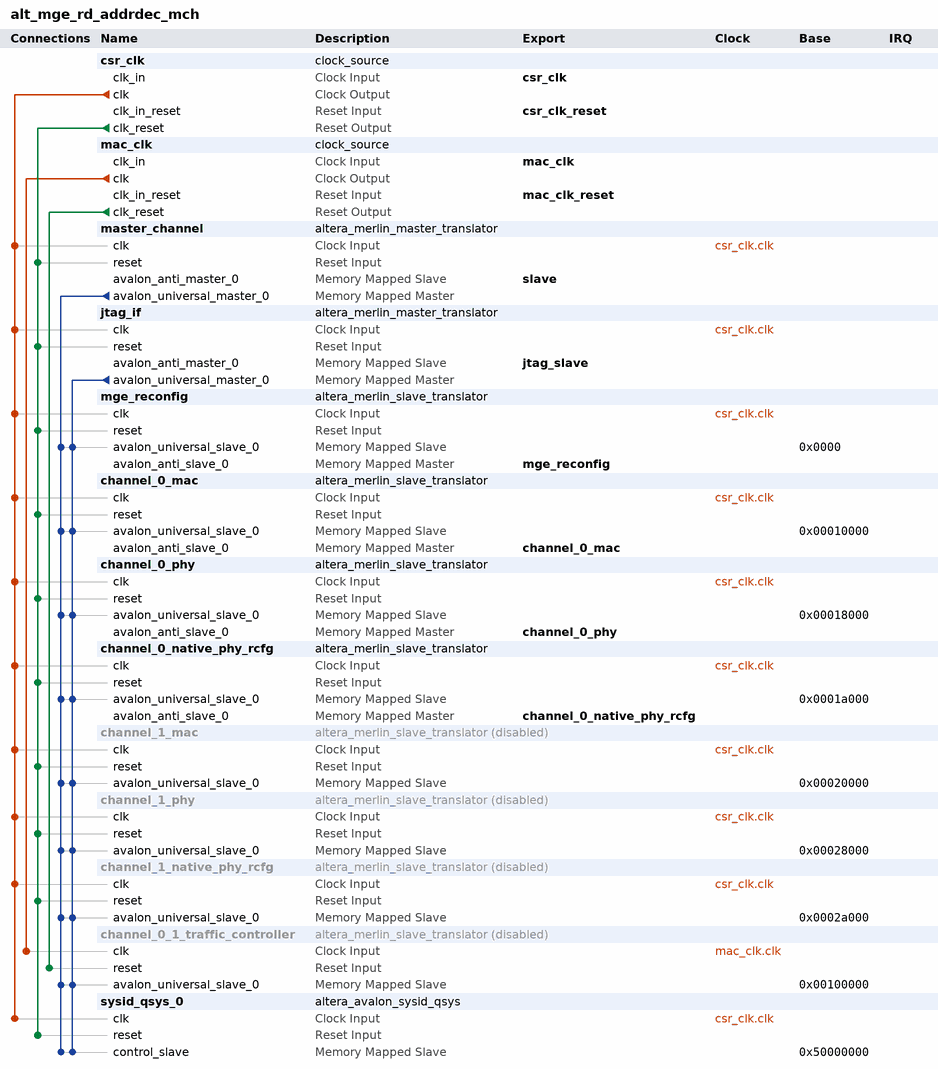
[diagram p0: system contents]
# Platform Designer (Qsys) system alt_mge_rd_addrdec_mch, Stratix 10 1SM21BHU2F53E1VG
# Parameters at their usual value, and those the tool derives, are not listed.
package require -exact qsys 1.0
create_system alt_mge_rd_addrdec_mch
set_project_property DEVICE_FAMILY {Stratix 10}
set_project_property DEVICE 1SM21BHU2F53E1VG

add_component csr_clk ip/alt_mge_rd_addrdec_mch/alt_mge_rd_addrdec_mch_csr_clk.ip clock_source csr_clk 
load_component csr_clk
set_component_parameter_value clockFrequency 125000000
save_component

add_component mac_clk ip/alt_mge_rd_addrdec_mch/alt_mge_rd_addrdec_mch_mac_clk.ip clock_source mac_clk 
load_component mac_clk
set_component_parameter_value clockFrequency 156250000
save_component

add_component master_channel ip/alt_mge_rd_addrdec_mch/alt_mge_rd_addrdec_mch_master_channel.ip altera_merlin_master_translator master_channel 19.1
load_component master_channel
set_component_parameter_value AV_ADDRESS_W 24
set_component_parameter_value AV_DATA_W 32
set_component_parameter_value AV_BURSTCOUNT_W 3
set_component_parameter_value AV_BYTEENABLE_W 4
set_component_parameter_value UAV_ADDRESS_W 32
set_component_parameter_value UAV_BURSTCOUNT_W 3
set_component_parameter_value AV_READLATENCY 0
set_component_parameter_value AV_WRITE_WAIT 0
set_component_parameter_value AV_READ_WAIT 0
set_component_parameter_value AV_DATA_HOLD 0
set_component_parameter_value AV_SETUP_WAIT 0
set_component_parameter_value USE_READDATA 1
set_component_parameter_value USE_WRITEDATA 1
set_component_parameter_value USE_READ 1
set_component_parameter_value USE_WRITE 1
set_component_parameter_value USE_BEGINBURSTTRANSFER 0
set_component_parameter_value USE_BEGINTRANSFER 0
set_component_parameter_value USE_BYTEENABLE 0
set_component_parameter_value USE_CHIPSELECT 0
set_component_parameter_value USE_ADDRESS 1
set_component_parameter_value USE_BURSTCOUNT 0
set_component_parameter_value USE_DEBUGACCESS 0
set_component_parameter_value USE_CLKEN 0
set_component_parameter_value USE_READDATAVALID 0
set_component_parameter_value USE_WAITREQUEST 1
set_component_parameter_value USE_LOCK 0
set_component_parameter_value USE_READRESPONSE 0
set_component_parameter_value USE_WRITERESPONSE 0
set_component_parameter_value AV_SYMBOLS_PER_WORD 4
set_component_parameter_value AV_ADDRESS_SYMBOLS 1
set_component_parameter_value AV_BURSTCOUNT_SYMBOLS 1
set_component_parameter_value AV_CONSTANT_BURST_BEHAVIOR 0
set_component_parameter_value UAV_CONSTANT_BURST_BEHAVIOR 0
set_component_parameter_value AV_LINEWRAPBURSTS 0
set_component_parameter_value AV_MAX_PENDING_READ_TRANSACTIONS 0
set_component_parameter_value AV_BURSTBOUNDARIES 0
set_component_parameter_value AV_INTERLEAVEBURSTS 0
set_component_parameter_value AV_BITS_PER_SYMBOL 8
set_component_parameter_value AV_ISBIGENDIAN 0
set_component_parameter_value AV_ADDRESSGROUP 0
set_component_parameter_value UAV_ADDRESSGROUP 0
set_component_parameter_value AV_REGISTEROUTGOINGSIGNALS 0
set_component_parameter_value AV_REGISTERINCOMINGSIGNALS 0
set_component_parameter_value AV_ALWAYSBURSTMAXBURST 0
set_component_parameter_value SYNC_RESET 0
set_component_parameter_value WAITREQUEST_ALLOWANCE 0
save_component

add_component jtag_if ip/alt_mge_rd_addrdec_mch/alt_mge_rd_addrdec_mch_jtag_if.ip altera_merlin_master_translator jtag_if 19.1
load_component jtag_if
set_component_parameter_value AV_ADDRESS_W 32
set_component_parameter_value AV_DATA_W 32
set_component_parameter_value AV_BURSTCOUNT_W 3
set_component_parameter_value AV_BYTEENABLE_W 4
set_component_parameter_value UAV_ADDRESS_W 32
set_component_parameter_value UAV_BURSTCOUNT_W 3
set_component_parameter_value AV_READLATENCY 0
set_component_parameter_value AV_WRITE_WAIT 0
set_component_parameter_value AV_READ_WAIT 0
set_component_parameter_value AV_DATA_HOLD 0
set_component_parameter_value AV_SETUP_WAIT 0
set_component_parameter_value USE_READDATA 1
set_component_parameter_value USE_WRITEDATA 1
set_component_parameter_value USE_READ 1
set_component_parameter_value USE_WRITE 1
set_component_parameter_value USE_BEGINBURSTTRANSFER 0
set_component_parameter_value USE_BEGINTRANSFER 0
set_component_parameter_value USE_BYTEENABLE 1
set_component_parameter_value USE_CHIPSELECT 0
set_component_parameter_value USE_ADDRESS 1
set_component_parameter_value USE_BURSTCOUNT 0
set_component_parameter_value USE_DEBUGACCESS 0
set_component_parameter_value USE_CLKEN 0
set_component_parameter_value USE_READDATAVALID 1
set_component_parameter_value USE_WAITREQUEST 1
set_component_parameter_value USE_LOCK 0
set_component_parameter_value USE_READRESPONSE 0
set_component_parameter_value USE_WRITERESPONSE 0
set_component_parameter_value AV_SYMBOLS_PER_WORD 4
set_component_parameter_value AV_ADDRESS_SYMBOLS 1
set_component_parameter_value AV_BURSTCOUNT_SYMBOLS 1
set_component_parameter_value AV_CONSTANT_BURST_BEHAVIOR 0
set_component_parameter_value UAV_CONSTANT_BURST_BEHAVIOR 0
set_component_parameter_value AV_LINEWRAPBURSTS 0
set_component_parameter_value AV_MAX_PENDING_READ_TRANSACTIONS 1
set_component_parameter_value AV_BURSTBOUNDARIES 0
set_component_parameter_value AV_INTERLEAVEBURSTS 0
set_component_parameter_value AV_BITS_PER_SYMBOL 8
set_component_parameter_value AV_ISBIGENDIAN 0
set_component_parameter_value AV_ADDRESSGROUP 0
set_component_parameter_value UAV_ADDRESSGROUP 0
set_component_parameter_value AV_REGISTEROUTGOINGSIGNALS 0
set_component_parameter_value AV_REGISTERINCOMINGSIGNALS 0
set_component_parameter_value AV_ALWAYSBURSTMAXBURST 0
set_component_parameter_value SYNC_RESET 0
set_component_parameter_value WAITREQUEST_ALLOWANCE 0
save_component

add_component mge_reconfig ip/alt_mge_rd_addrdec_mch/alt_mge_rd_addrdec_mch_mge_reconfig.ip altera_merlin_slave_translator mge_reconfig 19.1
load_component mge_reconfig
set_component_parameter_value AV_ADDRESS_W 2
set_component_parameter_value AV_DATA_W 32
set_component_parameter_value UAV_DATA_W 32
set_component_parameter_value AV_BURSTCOUNT_W 1
set_component_parameter_value AV_BYTEENABLE_W 4
set_component_parameter_value UAV_BYTEENABLE_W 4
set_component_parameter_value UAV_ADDRESS_W 4
set_component_parameter_value UAV_BURSTCOUNT_W 3
set_component_parameter_value AV_READLATENCY 1
set_component_parameter_value AV_SETUP_WAIT 0
set_component_parameter_value AV_WRITE_WAIT 0
set_component_parameter_value AV_READ_WAIT 0
set_component_parameter_value AV_DATA_HOLD 0
set_component_parameter_value AV_TIMING_UNITS 1
set_component_parameter_value USE_READDATA 1
set_component_parameter_value USE_WRITEDATA 1
set_component_parameter_value USE_READ 1
set_component_parameter_value USE_WRITE 1
set_component_parameter_value USE_BEGINBURSTTRANSFER 0
set_component_parameter_value USE_BEGINTRANSFER 0
set_component_parameter_value USE_BYTEENABLE 0
set_component_parameter_value USE_CHIPSELECT 0
set_component_parameter_value USE_ADDRESS 1
set_component_parameter_value USE_BURSTCOUNT 0
set_component_parameter_value USE_READDATAVALID 0
set_component_parameter_value USE_WAITREQUEST 0
set_component_parameter_value USE_WRITEBYTEENABLE 0
set_component_parameter_value USE_LOCK 0
set_component_parameter_value USE_AV_CLKEN 0
set_component_parameter_value USE_UAV_CLKEN 0
set_component_parameter_value USE_OUTPUTENABLE 0
set_component_parameter_value USE_DEBUGACCESS 0
set_component_parameter_value USE_READRESPONSE 0
set_component_parameter_value USE_WRITERESPONSE 0
set_component_parameter_value AV_SYMBOLS_PER_WORD 4
set_component_parameter_value AV_ADDRESS_SYMBOLS 0
set_component_parameter_value AV_BURSTCOUNT_SYMBOLS 1
set_component_parameter_value AV_CONSTANT_BURST_BEHAVIOR 0
set_component_parameter_value UAV_CONSTANT_BURST_BEHAVIOR 0
set_component_parameter_value AV_REQUIRE_UNALIGNED_ADDRESSES 0
set_component_parameter_value AV_LINEWRAPBURSTS 0
set_component_parameter_value AV_MAX_PENDING_READ_TRANSACTIONS 1
set_component_parameter_value AV_MAX_PENDING_WRITE_TRANSACTIONS 0
set_component_parameter_value AV_BURSTBOUNDARIES 0
set_component_parameter_value AV_INTERLEAVEBURSTS 0
set_component_parameter_value AV_BITS_PER_SYMBOL 8
set_component_parameter_value AV_ISBIGENDIAN 0
set_component_parameter_value AV_ADDRESSGROUP 0
set_component_parameter_value UAV_ADDRESSGROUP 0
set_component_parameter_value AV_REGISTEROUTGOINGSIGNALS 0
set_component_parameter_value AV_REGISTERINCOMINGSIGNALS 0
set_component_parameter_value AV_ALWAYSBURSTMAXBURST 0
set_component_parameter_value CHIPSELECT_THROUGH_READLATENCY 0
set_component_parameter_value CLOCK_RATE 125000000
set_component_parameter_value AV_READ_WAIT_CYCLES 0
set_component_parameter_value AV_WRITE_WAIT_CYCLES 0
set_component_parameter_value AV_SETUP_WAIT_CYCLES 0
set_component_parameter_value AV_DATA_HOLD_CYCLES 0
set_component_parameter_value WAITREQUEST_ALLOWANCE 0
set_component_parameter_value SYNC_RESET 0
save_component

add_component channel_0_mac ip/alt_mge_rd_addrdec_mch/alt_mge_rd_addrdec_mch_channel_0_mac.ip altera_merlin_slave_translator channel_0_mac 19.1
load_component channel_0_mac
set_component_parameter_value AV_ADDRESS_W 10
set_component_parameter_value AV_DATA_W 32
set_component_parameter_value UAV_DATA_W 32
set_component_parameter_value AV_BURSTCOUNT_W 1
set_component_parameter_value AV_BYTEENABLE_W 4
set_component_parameter_value UAV_BYTEENABLE_W 4
set_component_parameter_value UAV_ADDRESS_W 12
set_component_parameter_value UAV_BURSTCOUNT_W 3
set_component_parameter_value AV_READLATENCY 0
set_component_parameter_value AV_SETUP_WAIT 0
set_component_parameter_value AV_WRITE_WAIT 0
set_component_parameter_value AV_READ_WAIT 0
set_component_parameter_value AV_DATA_HOLD 0
set_component_parameter_value AV_TIMING_UNITS 1
set_component_parameter_value USE_READDATA 1
set_component_parameter_value USE_WRITEDATA 1
set_component_parameter_value USE_READ 1
set_component_parameter_value USE_WRITE 1
set_component_parameter_value USE_BEGINBURSTTRANSFER 0
set_component_parameter_value USE_BEGINTRANSFER 0
set_component_parameter_value USE_BYTEENABLE 0
set_component_parameter_value USE_CHIPSELECT 0
set_component_parameter_value USE_ADDRESS 1
set_component_parameter_value USE_BURSTCOUNT 0
set_component_parameter_value USE_READDATAVALID 0
set_component_parameter_value USE_WAITREQUEST 1
set_component_parameter_value USE_WRITEBYTEENABLE 0
set_component_parameter_value USE_LOCK 0
set_component_parameter_value USE_AV_CLKEN 0
set_component_parameter_value USE_UAV_CLKEN 0
set_component_parameter_value USE_OUTPUTENABLE 0
set_component_parameter_value USE_DEBUGACCESS 0
set_component_parameter_value USE_READRESPONSE 0
set_component_parameter_value USE_WRITERESPONSE 0
set_component_parameter_value AV_SYMBOLS_PER_WORD 4
set_component_parameter_value AV_ADDRESS_SYMBOLS 0
set_component_parameter_value AV_BURSTCOUNT_SYMBOLS 1
set_component_parameter_value AV_CONSTANT_BURST_BEHAVIOR 0
set_component_parameter_value UAV_CONSTANT_BURST_BEHAVIOR 0
set_component_parameter_value AV_REQUIRE_UNALIGNED_ADDRESSES 0
set_component_parameter_value AV_LINEWRAPBURSTS 0
set_component_parameter_value AV_MAX_PENDING_READ_TRANSACTIONS 1
set_component_parameter_value AV_MAX_PENDING_WRITE_TRANSACTIONS 0
set_component_parameter_value AV_BURSTBOUNDARIES 0
set_component_parameter_value AV_INTERLEAVEBURSTS 0
set_component_parameter_value AV_BITS_PER_SYMBOL 8
set_component_parameter_value AV_ISBIGENDIAN 0
set_component_parameter_value AV_ADDRESSGROUP 0
set_component_parameter_value UAV_ADDRESSGROUP 0
set_component_parameter_value AV_REGISTEROUTGOINGSIGNALS 0
set_component_parameter_value AV_REGISTERINCOMINGSIGNALS 0
set_component_parameter_value AV_ALWAYSBURSTMAXBURST 0
set_component_parameter_value CHIPSELECT_THROUGH_READLATENCY 0
set_component_parameter_value CLOCK_RATE 125000000
set_component_parameter_value AV_READ_WAIT_CYCLES 0
set_component_parameter_value AV_WRITE_WAIT_CYCLES 0
set_component_parameter_value AV_SETUP_WAIT_CYCLES 0
set_component_parameter_value AV_DATA_HOLD_CYCLES 0
set_component_parameter_value WAITREQUEST_ALLOWANCE 0
set_component_parameter_value SYNC_RESET 0
save_component

add_component channel_0_phy ip/alt_mge_rd_addrdec_mch/alt_mge_rd_addrdec_mch_channel_0_phy.ip altera_merlin_slave_translator channel_0_phy 19.1
load_component channel_0_phy
set_component_parameter_value AV_ADDRESS_W 5
set_component_parameter_value AV_DATA_W 32
set_component_parameter_value UAV_DATA_W 32
set_component_parameter_value AV_BURSTCOUNT_W 1
set_component_parameter_value AV_BYTEENABLE_W 4
set_component_parameter_value UAV_BYTEENABLE_W 4
set_component_parameter_value UAV_ADDRESS_W 7
set_component_parameter_value UAV_BURSTCOUNT_W 3
set_component_parameter_value AV_READLATENCY 0
set_component_parameter_value AV_SETUP_WAIT 0
set_component_parameter_value AV_WRITE_WAIT 0
set_component_parameter_value AV_READ_WAIT 0
set_component_parameter_value AV_DATA_HOLD 0
set_component_parameter_value AV_TIMING_UNITS 1
set_component_parameter_value USE_READDATA 1
set_component_parameter_value USE_WRITEDATA 1
set_component_parameter_value USE_READ 1
set_component_parameter_value USE_WRITE 1
set_component_parameter_value USE_BEGINBURSTTRANSFER 0
set_component_parameter_value USE_BEGINTRANSFER 0
set_component_parameter_value USE_BYTEENABLE 0
set_component_parameter_value USE_CHIPSELECT 0
set_component_parameter_value USE_ADDRESS 1
set_component_parameter_value USE_BURSTCOUNT 0
set_component_parameter_value USE_READDATAVALID 0
set_component_parameter_value USE_WAITREQUEST 1
set_component_parameter_value USE_WRITEBYTEENABLE 0
set_component_parameter_value USE_LOCK 0
set_component_parameter_value USE_AV_CLKEN 0
set_component_parameter_value USE_UAV_CLKEN 0
set_component_parameter_value USE_OUTPUTENABLE 0
set_component_parameter_value USE_DEBUGACCESS 0
set_component_parameter_value USE_READRESPONSE 0
set_component_parameter_value USE_WRITERESPONSE 0
set_component_parameter_value AV_SYMBOLS_PER_WORD 4
set_component_parameter_value AV_ADDRESS_SYMBOLS 0
set_component_parameter_value AV_BURSTCOUNT_SYMBOLS 1
set_component_parameter_value AV_CONSTANT_BURST_BEHAVIOR 0
set_component_parameter_value UAV_CONSTANT_BURST_BEHAVIOR 0
set_component_parameter_value AV_REQUIRE_UNALIGNED_ADDRESSES 0
set_component_parameter_value AV_LINEWRAPBURSTS 0
set_component_parameter_value AV_MAX_PENDING_READ_TRANSACTIONS 1
set_component_parameter_value AV_MAX_PENDING_WRITE_TRANSACTIONS 0
set_component_parameter_value AV_BURSTBOUNDARIES 0
set_component_parameter_value AV_INTERLEAVEBURSTS 0
set_component_parameter_value AV_BITS_PER_SYMBOL 8
set_component_parameter_value AV_ISBIGENDIAN 0
set_component_parameter_value AV_ADDRESSGROUP 0
set_component_parameter_value UAV_ADDRESSGROUP 0
set_component_parameter_value AV_REGISTEROUTGOINGSIGNALS 0
set_component_parameter_value AV_REGISTERINCOMINGSIGNALS 0
set_component_parameter_value AV_ALWAYSBURSTMAXBURST 0
set_component_parameter_value CHIPSELECT_THROUGH_READLATENCY 0
set_component_parameter_value CLOCK_RATE 125000000
set_component_parameter_value AV_READ_WAIT_CYCLES 0
set_component_parameter_value AV_WRITE_WAIT_CYCLES 0
set_component_parameter_value AV_SETUP_WAIT_CYCLES 0
set_component_parameter_value AV_DATA_HOLD_CYCLES 0
set_component_parameter_value WAITREQUEST_ALLOWANCE 0
set_component_parameter_value SYNC_RESET 0
save_component

add_component channel_0_native_phy_rcfg ip/alt_mge_rd_addrdec_mch/alt_mge_rd_addrdec_mch_channel_0_native_phy_rcfg.ip altera_merlin_slave_translator channel_0_native_phy_rcfg 19.1
load_component channel_0_native_phy_rcfg
set_component_parameter_value AV_ADDRESS_W 10
set_component_parameter_value AV_DATA_W 32
set_component_parameter_value UAV_DATA_W 32
set_component_parameter_value AV_BURSTCOUNT_W 1
set_component_parameter_value AV_BYTEENABLE_W 4
set_component_parameter_value UAV_BYTEENABLE_W 4
set_component_parameter_value UAV_ADDRESS_W 12
set_component_parameter_value UAV_BURSTCOUNT_W 3
set_component_parameter_value AV_READLATENCY 0
set_component_parameter_value AV_SETUP_WAIT 0
set_component_parameter_value AV_WRITE_WAIT 0
set_component_parameter_value AV_READ_WAIT 0
set_component_parameter_value AV_DATA_HOLD 0
set_component_parameter_value AV_TIMING_UNITS 1
set_component_parameter_value USE_READDATA 1
set_component_parameter_value USE_WRITEDATA 1
set_component_parameter_value USE_READ 1
set_component_parameter_value USE_WRITE 1
set_component_parameter_value USE_BEGINBURSTTRANSFER 0
set_component_parameter_value USE_BEGINTRANSFER 0
set_component_parameter_value USE_BYTEENABLE 0
set_component_parameter_value USE_CHIPSELECT 0
set_component_parameter_value USE_ADDRESS 1
set_component_parameter_value USE_BURSTCOUNT 0
set_component_parameter_value USE_READDATAVALID 0
set_component_parameter_value USE_WAITREQUEST 1
set_component_parameter_value USE_WRITEBYTEENABLE 0
set_component_parameter_value USE_LOCK 0
set_component_parameter_value USE_AV_CLKEN 0
set_component_parameter_value USE_UAV_CLKEN 0
set_component_parameter_value USE_OUTPUTENABLE 0
set_component_parameter_value USE_DEBUGACCESS 0
set_component_parameter_value USE_READRESPONSE 0
set_component_parameter_value USE_WRITERESPONSE 0
set_component_parameter_value AV_SYMBOLS_PER_WORD 4
set_component_parameter_value AV_ADDRESS_SYMBOLS 0
set_component_parameter_value AV_BURSTCOUNT_SYMBOLS 1
set_component_parameter_value AV_CONSTANT_BURST_BEHAVIOR 0
set_component_parameter_value UAV_CONSTANT_BURST_BEHAVIOR 0
set_component_parameter_value AV_REQUIRE_UNALIGNED_ADDRESSES 0
set_component_parameter_value AV_LINEWRAPBURSTS 0
set_component_parameter_value AV_MAX_PENDING_READ_TRANSACTIONS 1
set_component_parameter_value AV_MAX_PENDING_WRITE_TRANSACTIONS 0
set_component_parameter_value AV_BURSTBOUNDARIES 0
set_component_parameter_value AV_INTERLEAVEBURSTS 0
set_component_parameter_value AV_BITS_PER_SYMBOL 8
set_component_parameter_value AV_ISBIGENDIAN 0
set_component_parameter_value AV_ADDRESSGROUP 0
set_component_parameter_value UAV_ADDRESSGROUP 0
set_component_parameter_value AV_REGISTEROUTGOINGSIGNALS 0
set_component_parameter_value AV_REGISTERINCOMINGSIGNALS 0
set_component_parameter_value AV_ALWAYSBURSTMAXBURST 0
set_component_parameter_value CHIPSELECT_THROUGH_READLATENCY 0
set_component_parameter_value CLOCK_RATE 125000000
set_component_parameter_value AV_READ_WAIT_CYCLES 0
set_component_parameter_value AV_WRITE_WAIT_CYCLES 0
set_component_parameter_value AV_SETUP_WAIT_CYCLES 0
set_component_parameter_value AV_DATA_HOLD_CYCLES 0
set_component_parameter_value WAITREQUEST_ALLOWANCE 0
set_component_parameter_value SYNC_RESET 0
save_component

add_component channel_1_mac ip/alt_mge_rd_addrdec_mch/alt_mge_rd_addrdec_mch_channel_1_mac.ip altera_merlin_slave_translator channel_1_mac 19.1
load_component channel_1_mac
set_instance_property channel_1_mac ENABLED false
set_component_parameter_value AV_ADDRESS_W 10
set_component_parameter_value AV_DATA_W 32
set_component_parameter_value UAV_DATA_W 32
set_component_parameter_value AV_BURSTCOUNT_W 1
set_component_parameter_value AV_BYTEENABLE_W 4
set_component_parameter_value UAV_BYTEENABLE_W 4
set_component_parameter_value UAV_ADDRESS_W 12
set_component_parameter_value UAV_BURSTCOUNT_W 3
set_component_parameter_value AV_READLATENCY 0
set_component_parameter_value AV_SETUP_WAIT 0
set_component_parameter_value AV_WRITE_WAIT 0
set_component_parameter_value AV_READ_WAIT 0
set_component_parameter_value AV_DATA_HOLD 0
set_component_parameter_value AV_TIMING_UNITS 1
set_component_parameter_value USE_READDATA 1
set_component_parameter_value USE_WRITEDATA 1
set_component_parameter_value USE_READ 1
set_component_parameter_value USE_WRITE 1
set_component_parameter_value USE_BEGINBURSTTRANSFER 0
set_component_parameter_value USE_BEGINTRANSFER 0
set_component_parameter_value USE_BYTEENABLE 0
set_component_parameter_value USE_CHIPSELECT 0
set_component_parameter_value USE_ADDRESS 1
set_component_parameter_value USE_BURSTCOUNT 0
set_component_parameter_value USE_READDATAVALID 0
set_component_parameter_value USE_WAITREQUEST 1
set_component_parameter_value USE_WRITEBYTEENABLE 0
set_component_parameter_value USE_LOCK 0
set_component_parameter_value USE_AV_CLKEN 0
set_component_parameter_value USE_UAV_CLKEN 0
set_component_parameter_value USE_OUTPUTENABLE 0
set_component_parameter_value USE_DEBUGACCESS 0
set_component_parameter_value USE_READRESPONSE 0
set_component_parameter_value USE_WRITERESPONSE 0
set_component_parameter_value AV_SYMBOLS_PER_WORD 4
set_component_parameter_value AV_ADDRESS_SYMBOLS 0
set_component_parameter_value AV_BURSTCOUNT_SYMBOLS 1
set_component_parameter_value AV_CONSTANT_BURST_BEHAVIOR 0
set_component_parameter_value UAV_CONSTANT_BURST_BEHAVIOR 0
set_component_parameter_value AV_REQUIRE_UNALIGNED_ADDRESSES 0
set_component_parameter_value AV_LINEWRAPBURSTS 0
set_component_parameter_value AV_MAX_PENDING_READ_TRANSACTIONS 1
set_component_parameter_value AV_MAX_PENDING_WRITE_TRANSACTIONS 0
set_component_parameter_value AV_BURSTBOUNDARIES 0
set_component_parameter_value AV_INTERLEAVEBURSTS 0
set_component_parameter_value AV_BITS_PER_SYMBOL 8
set_component_parameter_value AV_ISBIGENDIAN 0
set_component_parameter_value AV_ADDRESSGROUP 0
set_component_parameter_value UAV_ADDRESSGROUP 0
set_component_parameter_value AV_REGISTEROUTGOINGSIGNALS 0
set_component_parameter_value AV_REGISTERINCOMINGSIGNALS 0
set_component_parameter_value AV_ALWAYSBURSTMAXBURST 0
set_component_parameter_value CHIPSELECT_THROUGH_READLATENCY 0
set_component_parameter_value CLOCK_RATE 125000000
set_component_parameter_value AV_READ_WAIT_CYCLES 0
set_component_parameter_value AV_WRITE_WAIT_CYCLES 0
set_component_parameter_value AV_SETUP_WAIT_CYCLES 0
set_component_parameter_value AV_DATA_HOLD_CYCLES 0
set_component_parameter_value WAITREQUEST_ALLOWANCE 0
set_component_parameter_value SYNC_RESET 0
save_component

add_component channel_1_phy ip/alt_mge_rd_addrdec_mch/alt_mge_rd_addrdec_mch_channel_1_phy.ip altera_merlin_slave_translator channel_1_phy 19.1
load_component channel_1_phy
set_instance_property channel_1_phy ENABLED false
set_component_parameter_value AV_ADDRESS_W 5
set_component_parameter_value AV_DATA_W 32
set_component_parameter_value UAV_DATA_W 32
set_component_parameter_value AV_BURSTCOUNT_W 1
set_component_parameter_value AV_BYTEENABLE_W 4
set_component_parameter_value UAV_BYTEENABLE_W 4
set_component_parameter_value UAV_ADDRESS_W 7
set_component_parameter_value UAV_BURSTCOUNT_W 3
set_component_parameter_value AV_READLATENCY 0
set_component_parameter_value AV_SETUP_WAIT 0
set_component_parameter_value AV_WRITE_WAIT 0
set_component_parameter_value AV_READ_WAIT 0
set_component_parameter_value AV_DATA_HOLD 0
set_component_parameter_value AV_TIMING_UNITS 1
set_component_parameter_value USE_READDATA 1
set_component_parameter_value USE_WRITEDATA 1
set_component_parameter_value USE_READ 1
set_component_parameter_value USE_WRITE 1
set_component_parameter_value USE_BEGINBURSTTRANSFER 0
set_component_parameter_value USE_BEGINTRANSFER 0
set_component_parameter_value USE_BYTEENABLE 0
set_component_parameter_value USE_CHIPSELECT 0
set_component_parameter_value USE_ADDRESS 1
set_component_parameter_value USE_BURSTCOUNT 0
set_component_parameter_value USE_READDATAVALID 0
set_component_parameter_value USE_WAITREQUEST 1
set_component_parameter_value USE_WRITEBYTEENABLE 0
set_component_parameter_value USE_LOCK 0
set_component_parameter_value USE_AV_CLKEN 0
set_component_parameter_value USE_UAV_CLKEN 0
set_component_parameter_value USE_OUTPUTENABLE 0
set_component_parameter_value USE_DEBUGACCESS 0
set_component_parameter_value USE_READRESPONSE 0
set_component_parameter_value USE_WRITERESPONSE 0
set_component_parameter_value AV_SYMBOLS_PER_WORD 4
set_component_parameter_value AV_ADDRESS_SYMBOLS 0
set_component_parameter_value AV_BURSTCOUNT_SYMBOLS 1
set_component_parameter_value AV_CONSTANT_BURST_BEHAVIOR 0
set_component_parameter_value UAV_CONSTANT_BURST_BEHAVIOR 0
set_component_parameter_value AV_REQUIRE_UNALIGNED_ADDRESSES 0
set_component_parameter_value AV_LINEWRAPBURSTS 0
set_component_parameter_value AV_MAX_PENDING_READ_TRANSACTIONS 1
set_component_parameter_value AV_MAX_PENDING_WRITE_TRANSACTIONS 0
set_component_parameter_value AV_BURSTBOUNDARIES 0
set_component_parameter_value AV_INTERLEAVEBURSTS 0
set_component_parameter_value AV_BITS_PER_SYMBOL 8
set_component_parameter_value AV_ISBIGENDIAN 0
set_component_parameter_value AV_ADDRESSGROUP 0
set_component_parameter_value UAV_ADDRESSGROUP 0
set_component_parameter_value AV_REGISTEROUTGOINGSIGNALS 0
set_component_parameter_value AV_REGISTERINCOMINGSIGNALS 0
set_component_parameter_value AV_ALWAYSBURSTMAXBURST 0
set_component_parameter_value CHIPSELECT_THROUGH_READLATENCY 0
set_component_parameter_value CLOCK_RATE 125000000
set_component_parameter_value AV_READ_WAIT_CYCLES 0
set_component_parameter_value AV_WRITE_WAIT_CYCLES 0
set_component_parameter_value AV_SETUP_WAIT_CYCLES 0
set_component_parameter_value AV_DATA_HOLD_CYCLES 0
set_component_parameter_value WAITREQUEST_ALLOWANCE 0
set_component_parameter_value SYNC_RESET 0
save_component

add_component channel_1_native_phy_rcfg ip/alt_mge_rd_addrdec_mch/alt_mge_rd_addrdec_mch_channel_1_native_phy_rcfg.ip altera_merlin_slave_translator channel_1_native_phy_rcfg 19.1
load_component channel_1_native_phy_rcfg
set_instance_property channel_1_native_phy_rcfg ENABLED false
set_component_parameter_value AV_ADDRESS_W 10
set_component_parameter_value AV_DATA_W 32
set_component_parameter_value UAV_DATA_W 32
set_component_parameter_value AV_BURSTCOUNT_W 1
set_component_parameter_value AV_BYTEENABLE_W 4
set_component_parameter_value UAV_BYTEENABLE_W 4
set_component_parameter_value UAV_ADDRESS_W 12
set_component_parameter_value UAV_BURSTCOUNT_W 3
set_component_parameter_value AV_READLATENCY 0
set_component_parameter_value AV_SETUP_WAIT 0
set_component_parameter_value AV_WRITE_WAIT 0
set_component_parameter_value AV_READ_WAIT 0
set_component_parameter_value AV_DATA_HOLD 0
set_component_parameter_value AV_TIMING_UNITS 1
set_component_parameter_value USE_READDATA 1
set_component_parameter_value USE_WRITEDATA 1
set_component_parameter_value USE_READ 1
set_component_parameter_value USE_WRITE 1
set_component_parameter_value USE_BEGINBURSTTRANSFER 0
set_component_parameter_value USE_BEGINTRANSFER 0
set_component_parameter_value USE_BYTEENABLE 0
set_component_parameter_value USE_CHIPSELECT 0
set_component_parameter_value USE_ADDRESS 1
set_component_parameter_value USE_BURSTCOUNT 0
set_component_parameter_value USE_READDATAVALID 0
set_component_parameter_value USE_WAITREQUEST 1
set_component_parameter_value USE_WRITEBYTEENABLE 0
set_component_parameter_value USE_LOCK 0
set_component_parameter_value USE_AV_CLKEN 0
set_component_parameter_value USE_UAV_CLKEN 0
set_component_parameter_value USE_OUTPUTENABLE 0
set_component_parameter_value USE_DEBUGACCESS 0
set_component_parameter_value USE_READRESPONSE 0
set_component_parameter_value USE_WRITERESPONSE 0
set_component_parameter_value AV_SYMBOLS_PER_WORD 4
set_component_parameter_value AV_ADDRESS_SYMBOLS 0
set_component_parameter_value AV_BURSTCOUNT_SYMBOLS 1
set_component_parameter_value AV_CONSTANT_BURST_BEHAVIOR 0
set_component_parameter_value UAV_CONSTANT_BURST_BEHAVIOR 0
set_component_parameter_value AV_REQUIRE_UNALIGNED_ADDRESSES 0
set_component_parameter_value AV_LINEWRAPBURSTS 0
set_component_parameter_value AV_MAX_PENDING_READ_TRANSACTIONS 1
set_component_parameter_value AV_MAX_PENDING_WRITE_TRANSACTIONS 0
set_component_parameter_value AV_BURSTBOUNDARIES 0
set_component_parameter_value AV_INTERLEAVEBURSTS 0
set_component_parameter_value AV_BITS_PER_SYMBOL 8
set_component_parameter_value AV_ISBIGENDIAN 0
set_component_parameter_value AV_ADDRESSGROUP 0
set_component_parameter_value UAV_ADDRESSGROUP 0
set_component_parameter_value AV_REGISTEROUTGOINGSIGNALS 0
set_component_parameter_value AV_REGISTERINCOMINGSIGNALS 0
set_component_parameter_value AV_ALWAYSBURSTMAXBURST 0
set_component_parameter_value CHIPSELECT_THROUGH_READLATENCY 0
set_component_parameter_value CLOCK_RATE 125000000
set_component_parameter_value AV_READ_WAIT_CYCLES 0
set_component_parameter_value AV_WRITE_WAIT_CYCLES 0
set_component_parameter_value AV_SETUP_WAIT_CYCLES 0
set_component_parameter_value AV_DATA_HOLD_CYCLES 0
set_component_parameter_value WAITREQUEST_ALLOWANCE 0
set_component_parameter_value SYNC_RESET 0
save_component

add_component channel_0_1_traffic_controller ip/alt_mge_rd_addrdec_mch/alt_mge_rd_addrdec_mch_channel_0_1_traffic_controller.ip altera_merlin_slave_translator channel_0_1_traffic_controller 19.1
load_component channel_0_1_traffic_controller
set_instance_property channel_0_1_traffic_controller ENABLED false
set_component_parameter_value AV_ADDRESS_W 12
set_component_parameter_value AV_DATA_W 32
set_component_parameter_value UAV_DATA_W 32
set_component_parameter_value AV_BURSTCOUNT_W 1
set_component_parameter_value AV_BYTEENABLE_W 4
set_component_parameter_value UAV_BYTEENABLE_W 4
set_component_parameter_value UAV_ADDRESS_W 14
set_component_parameter_value UAV_BURSTCOUNT_W 3
set_component_parameter_value AV_READLATENCY 0
set_component_parameter_value AV_SETUP_WAIT 0
set_component_parameter_value AV_WRITE_WAIT 0
set_component_parameter_value AV_READ_WAIT 0
set_component_parameter_value AV_DATA_HOLD 0
set_component_parameter_value AV_TIMING_UNITS 1
set_component_parameter_value USE_READDATA 1
set_component_parameter_value USE_WRITEDATA 1
set_component_parameter_value USE_READ 1
set_component_parameter_value USE_WRITE 1
set_component_parameter_value USE_BEGINBURSTTRANSFER 0
set_component_parameter_value USE_BEGINTRANSFER 0
set_component_parameter_value USE_BYTEENABLE 0
set_component_parameter_value USE_CHIPSELECT 0
set_component_parameter_value USE_ADDRESS 1
set_component_parameter_value USE_BURSTCOUNT 0
set_component_parameter_value USE_READDATAVALID 0
set_component_parameter_value USE_WAITREQUEST 1
set_component_parameter_value USE_WRITEBYTEENABLE 0
set_component_parameter_value USE_LOCK 0
set_component_parameter_value USE_AV_CLKEN 0
set_component_parameter_value USE_UAV_CLKEN 0
set_component_parameter_value USE_OUTPUTENABLE 0
set_component_parameter_value USE_DEBUGACCESS 0
set_component_parameter_value USE_READRESPONSE 0
set_component_parameter_value USE_WRITERESPONSE 0
set_component_parameter_value AV_SYMBOLS_PER_WORD 4
set_component_parameter_value AV_ADDRESS_SYMBOLS 0
set_component_parameter_value AV_BURSTCOUNT_SYMBOLS 1
set_component_parameter_value AV_CONSTANT_BURST_BEHAVIOR 0
set_component_parameter_value UAV_CONSTANT_BURST_BEHAVIOR 0
set_component_parameter_value AV_REQUIRE_UNALIGNED_ADDRESSES 0
set_component_parameter_value AV_LINEWRAPBURSTS 0
set_component_parameter_value AV_MAX_PENDING_READ_TRANSACTIONS 1
set_component_parameter_value AV_MAX_PENDING_WRITE_TRANSACTIONS 0
set_component_parameter_value AV_BURSTBOUNDARIES 0
set_component_parameter_value AV_INTERLEAVEBURSTS 0
set_component_parameter_value AV_BITS_PER_SYMBOL 8
set_component_parameter_value AV_ISBIGENDIAN 0
set_component_parameter_value AV_ADDRESSGROUP 0
set_component_parameter_value UAV_ADDRESSGROUP 0
set_component_parameter_value AV_REGISTEROUTGOINGSIGNALS 0
set_component_parameter_value AV_REGISTERINCOMINGSIGNALS 0
set_component_parameter_value AV_ALWAYSBURSTMAXBURST 0
set_component_parameter_value CHIPSELECT_THROUGH_READLATENCY 0
set_component_parameter_value CLOCK_RATE 156250000
set_component_parameter_value AV_READ_WAIT_CYCLES 0
set_component_parameter_value AV_WRITE_WAIT_CYCLES 0
set_component_parameter_value AV_SETUP_WAIT_CYCLES 0
set_component_parameter_value AV_DATA_HOLD_CYCLES 0
set_component_parameter_value WAITREQUEST_ALLOWANCE 0
set_component_parameter_value SYNC_RESET 0
save_component

add_component sysid_qsys_0 ip/alt_mge_rd_addrdec_mch/alt_mge_rd_addrdec_mch_sysid_qsys_0.ip altera_avalon_sysid_qsys sysid_qsys_0 19.1
load_component sysid_qsys_0
set_component_parameter_value id 1347440720
set_component_parameter_value ID_VALUE 1347440720
set_component_parameter_value TIMESTAMP 0
save_component

# connections
add_connection csr_clk.clk channel_0_mac.clk clock
add_connection csr_clk.clk channel_0_native_phy_rcfg.clk clock
add_connection csr_clk.clk channel_0_phy.clk clock
add_connection csr_clk.clk channel_1_mac.clk clock
add_connection csr_clk.clk channel_1_native_phy_rcfg.clk clock
add_connection csr_clk.clk channel_1_phy.clk clock
add_connection csr_clk.clk jtag_if.clk clock
add_connection csr_clk.clk master_channel.clk clock
add_connection csr_clk.clk mge_reconfig.clk clock
add_connection csr_clk.clk sysid_qsys_0.clk clock
add_connection mac_clk.clk channel_0_1_traffic_controller.clk clock
add_connection csr_clk.clk_reset channel_0_mac.reset reset
add_connection csr_clk.clk_reset channel_0_native_phy_rcfg.reset reset
add_connection csr_clk.clk_reset channel_0_phy.reset reset
add_connection csr_clk.clk_reset channel_1_mac.reset reset
add_connection csr_clk.clk_reset channel_1_native_phy_rcfg.reset reset
add_connection csr_clk.clk_reset channel_1_phy.reset reset
add_connection csr_clk.clk_reset jtag_if.reset reset
add_connection csr_clk.clk_reset master_channel.reset reset
add_connection csr_clk.clk_reset mge_reconfig.reset reset
add_connection csr_clk.clk_reset sysid_qsys_0.reset reset
add_connection mac_clk.clk_reset channel_0_1_traffic_controller.reset reset
add_connection jtag_if.avalon_universal_master_0 channel_0_1_traffic_controller.avalon_universal_slave_0 avalon
set_connection_parameter_value jtag_if.avalon_universal_master_0/channel_0_1_traffic_controller.avalon_universal_slave_0 baseAddress 0x00100000
add_connection jtag_if.avalon_universal_master_0 channel_0_mac.avalon_universal_slave_0 avalon
set_connection_parameter_value jtag_if.avalon_universal_master_0/channel_0_mac.avalon_universal_slave_0 baseAddress 0x00010000
add_connection jtag_if.avalon_universal_master_0 channel_0_native_phy_rcfg.avalon_universal_slave_0 avalon
set_connection_parameter_value jtag_if.avalon_universal_master_0/channel_0_native_phy_rcfg.avalon_universal_slave_0 baseAddress 0x0001a000
add_connection jtag_if.avalon_universal_master_0 channel_0_phy.avalon_universal_slave_0 avalon
set_connection_parameter_value jtag_if.avalon_universal_master_0/channel_0_phy.avalon_universal_slave_0 baseAddress 0x00018000
add_connection jtag_if.avalon_universal_master_0 channel_1_mac.avalon_universal_slave_0 avalon
set_connection_parameter_value jtag_if.avalon_universal_master_0/channel_1_mac.avalon_universal_slave_0 baseAddress 0x00020000
add_connection jtag_if.avalon_universal_master_0 channel_1_native_phy_rcfg.avalon_universal_slave_0 avalon
set_connection_parameter_value jtag_if.avalon_universal_master_0/channel_1_native_phy_rcfg.avalon_universal_slave_0 baseAddress 0x0002a000
add_connection jtag_if.avalon_universal_master_0 channel_1_phy.avalon_universal_slave_0 avalon
set_connection_parameter_value jtag_if.avalon_universal_master_0/channel_1_phy.avalon_universal_slave_0 baseAddress 0x00028000
add_connection jtag_if.avalon_universal_master_0 mge_reconfig.avalon_universal_slave_0 avalon
set_connection_parameter_value jtag_if.avalon_universal_master_0/mge_reconfig.avalon_universal_slave_0 baseAddress 0x0000
add_connection jtag_if.avalon_universal_master_0 sysid_qsys_0.control_slave avalon
set_connection_parameter_value jtag_if.avalon_universal_master_0/sysid_qsys_0.control_slave baseAddress 0x50000000
add_connection master_channel.avalon_universal_master_0 channel_0_1_traffic_controller.avalon_universal_slave_0 avalon
set_connection_parameter_value master_channel.avalon_universal_master_0/channel_0_1_traffic_controller.avalon_universal_slave_0 baseAddress 0x00100000
add_connection master_channel.avalon_universal_master_0 channel_0_mac.avalon_universal_slave_0 avalon
set_connection_parameter_value master_channel.avalon_universal_master_0/channel_0_mac.avalon_universal_slave_0 baseAddress 0x00010000
add_connection master_channel.avalon_universal_master_0 channel_0_native_phy_rcfg.avalon_universal_slave_0 avalon
set_connection_parameter_value master_channel.avalon_universal_master_0/channel_0_native_phy_rcfg.avalon_universal_slave_0 baseAddress 0x0001a000
add_connection master_channel.avalon_universal_master_0 channel_0_phy.avalon_universal_slave_0 avalon
set_connection_parameter_value master_channel.avalon_universal_master_0/channel_0_phy.avalon_universal_slave_0 baseAddress 0x00018000
add_connection master_channel.avalon_universal_master_0 channel_1_mac.avalon_universal_slave_0 avalon
set_connection_parameter_value master_channel.avalon_universal_master_0/channel_1_mac.avalon_universal_slave_0 baseAddress 0x00020000
add_connection master_channel.avalon_universal_master_0 channel_1_native_phy_rcfg.avalon_universal_slave_0 avalon
set_connection_parameter_value master_channel.avalon_universal_master_0/channel_1_native_phy_rcfg.avalon_universal_slave_0 baseAddress 0x0002a000
add_connection master_channel.avalon_universal_master_0 channel_1_phy.avalon_universal_slave_0 avalon
set_connection_parameter_value master_channel.avalon_universal_master_0/channel_1_phy.avalon_universal_slave_0 baseAddress 0x00028000
add_connection master_channel.avalon_universal_master_0 mge_reconfig.avalon_universal_slave_0 avalon
set_connection_parameter_value master_channel.avalon_universal_master_0/mge_reconfig.avalon_universal_slave_0 baseAddress 0x0000
add_connection master_channel.avalon_universal_master_0 sysid_qsys_0.control_slave avalon
set_connection_parameter_value master_channel.avalon_universal_master_0/sysid_qsys_0.control_slave baseAddress 0x50000000

# exported interfaces
add_interface channel_0_mac avalon master
set_interface_property channel_0_mac EXPORT_OF channel_0_mac.avalon_anti_slave_0
add_interface channel_0_native_phy_rcfg avalon master
set_interface_property channel_0_native_phy_rcfg EXPORT_OF channel_0_native_phy_rcfg.avalon_anti_slave_0
add_interface channel_0_phy avalon master
set_interface_property channel_0_phy EXPORT_OF channel_0_phy.avalon_anti_slave_0
add_interface csr_clk clock sink
set_interface_property csr_clk EXPORT_OF csr_clk.clk_in
add_interface csr_clk_reset reset sink
set_interface_property csr_clk_reset EXPORT_OF csr_clk.clk_in_reset
add_interface jtag_slave avalon slave
set_interface_property jtag_slave EXPORT_OF jtag_if.avalon_anti_master_0
add_interface mac_clk clock sink
set_interface_property mac_clk EXPORT_OF mac_clk.clk_in
add_interface mac_clk_reset reset sink
set_interface_property mac_clk_reset EXPORT_OF mac_clk.clk_in_reset
add_interface mge_reconfig avalon master
set_interface_property mge_reconfig EXPORT_OF mge_reconfig.avalon_anti_slave_0
add_interface slave avalon slave
set_interface_property slave EXPORT_OF master_channel.avalon_anti_master_0

save_system alt_mge_rd_addrdec_mch.qsys
